# Altium project FOC测试板.PrjPCB
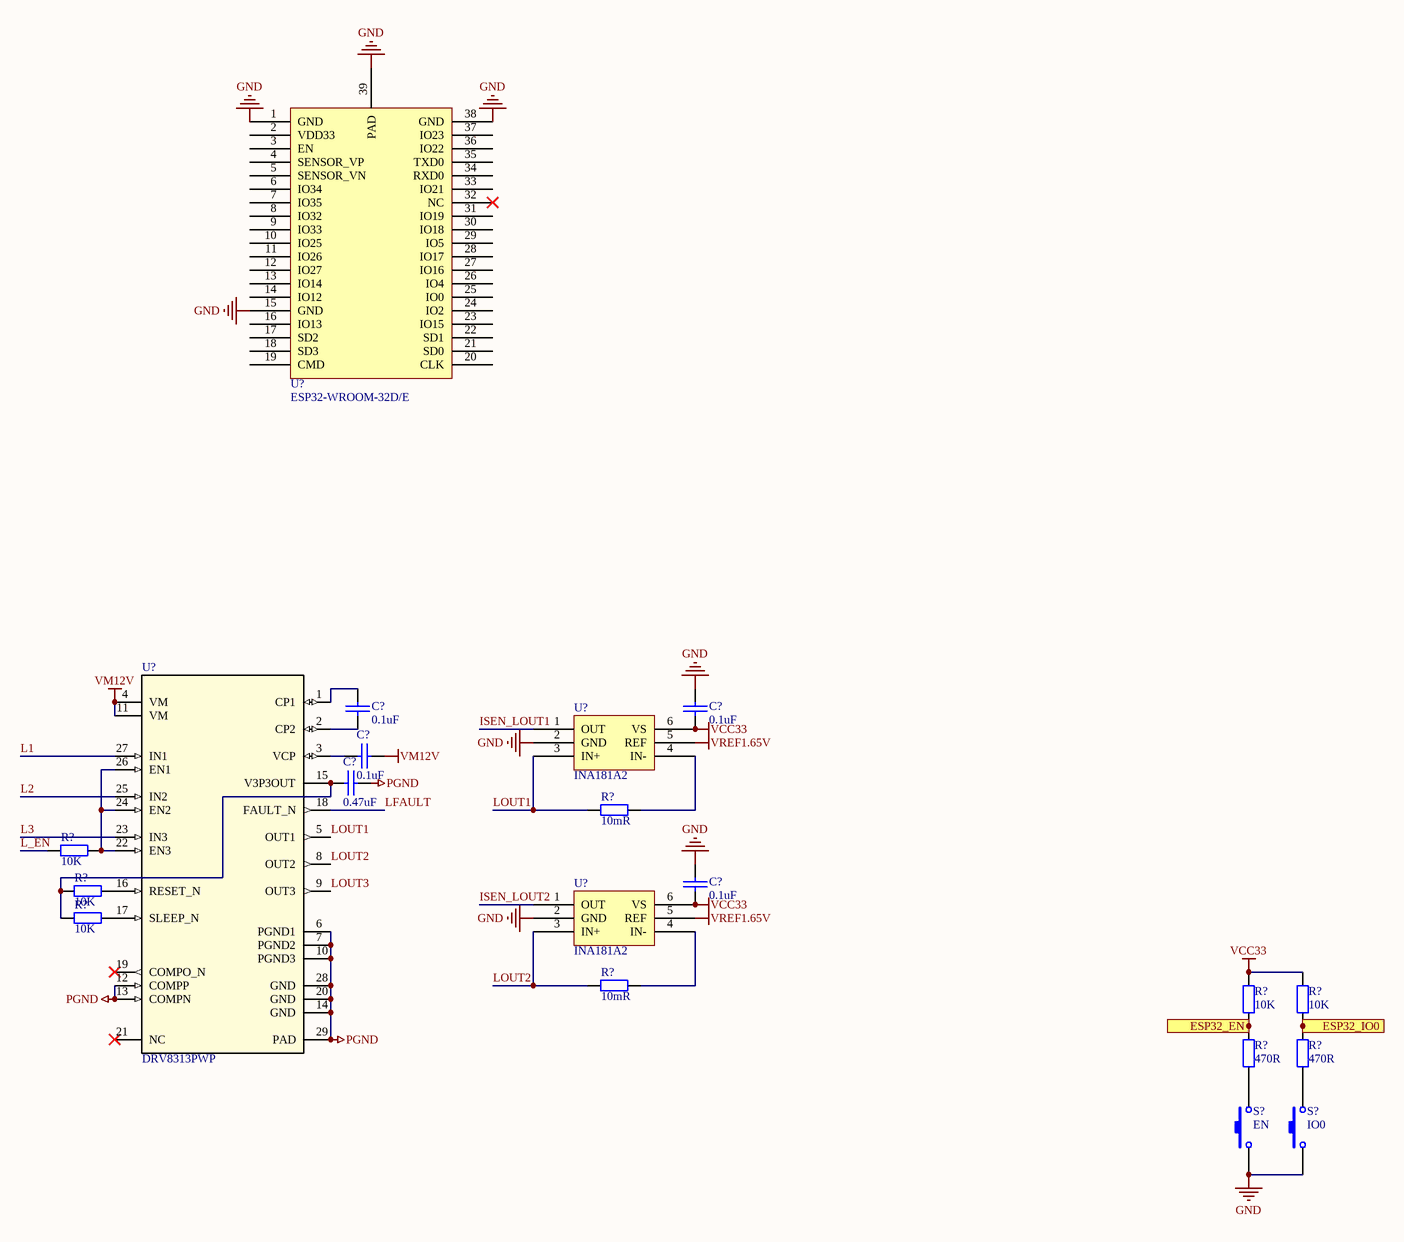
[diagram p0: 原理图.SchDoc]
1 sheet, 20 parts. Net scope: flat (ports and power ports of the same name join across sheets).
Board file: 电路板.PcbDoc

## Sheet 原理图.SchDoc
size A3

### Parts
(Parts that share a designator on the sheet are numbered #1, #2 ... from top to bottom, then left to right.)
C?#1  0.1uF  [C0805_M]
C?#2  0.1uF  [C0805_M]
C?#3  0.1uF  [C0805_M]
C?#4  0.47uF  [C0805_M]
C?#5  0.1uF  [C0805_M]
R?#1  10mR  [R0805_M]
R?#2  10K  [R0805_M]
R?#3  10K  [R0805_M]
R?#4  10K  [R0805_M]
R?#5  10mR  [R0805_M]
R?#6  10K  [R0805_M]
R?#7  10K  [R0805_M]
R?#8  470R  [R0805_M]
R?#9  470R  [R0805_M]
S?#1  EN  [SW_SMT]
S?#2  IO0  [SW_SMT]
U?#1  ESP32-WROOM-32D/E  [ESP32-WROOM-32D/E]
U?#2  INA181A2  [SOT23-6]
U?#3  DRV8313PWP  [TSSOP28-POWERPAD]
U?#4  INA181A2  [SOT23-6]

### Ports
ESP32_EN, ESP32_IO0

### Nets
GND: C?#2.2 C?#5.2 S?#1.1 S?#2.1 U?#1.1(GND) U?#1.15(GND) U?#1.38(GND) U?#1.39(PAD) U?#2.2(GND) U?#4.2(GND)
PGND: C?#4.1 U?#3.6(PGND1) U?#3.7(PGND2) U?#3.10(PGND3) U?#3.12(COMPP) U?#3.13(COMPN) U?#3.14(GND) U?#3.20(GND) U?#3.28(GND) U?#3.29(PAD)
VCC33: C?#2.1 C?#5.1 R?#6.2 R?#7.2 U?#2.6(VS) U?#4.6(VS)
VM12V: C?#3.1 U?#3.4(VM) U?#3.11(VM)
VREF1.65V: U?#2.5(REF) U?#4.5(REF)
ISEN_LOUT1: U?#2.1(OUT)
ISEN_LOUT2: U?#4.1(OUT)
L1: U?#3.27(IN1)
L2: U?#3.25(IN2)
L3: U?#3.23(IN3)
L_EN: R?#2.2
LFAULT: U?#3.18(FAULT_N)
LOUT1: R?#1.2 U?#2.3(IN+) U?#3.5(OUT1)
LOUT2: R?#5.2 U?#3.8(OUT2) U?#4.3(IN+)
LOUT3: U?#3.9(OUT3)
NetC?#1_1: C?#1.1 U?#3.2(CP2)
NetC?#1_2: C?#1.2 U?#3.1(CP1)
NetC?#3_2: C?#3.2 U?#3.3(VCP)
NetC?#4_2: C?#4.2 R?#3.2 R?#4.2 U?#3.15(V3P3OUT)
NetR?#1_1: R?#1.1 U?#2.4(IN-)
NetR?#2_1: R?#2.1 U?#3.22(EN3) U?#3.24(EN2) U?#3.26(EN1)
NetR?#3_1: R?#3.1 U?#3.16(RESET_N)
NetR?#4_1: R?#4.1 U?#3.17(SLEEP_N)
NetR?#5_1: R?#5.1 U?#4.4(IN-)
NetR?#6_1: R?#6.1 R?#8.2 ; port ESP32_EN
NetR?#7_1: R?#7.1 R?#9.2 ; port ESP32_IO0
NetR?#8_1: R?#8.1 S?#1.2
NetR?#9_1: R?#9.1 S?#2.2

Not connected (* = marked no-connect by the designer): U?#1 2(VDD33) 3(EN) 4(SENSOR_VP) 5(SENSOR_VN) 6(IO34) 7(IO35) 8(IO32) 9(IO33) 10(IO25) 11(IO26) 12(IO27) 13(IO14) 14(IO12) 16(IO13) 17(SD2) 18(SD3) 19(CMD) 20(CLK) 21(SD0) 22(SD1) 23(IO15) 24(IO2) 25(IO0) 26(IO4) 27(IO16) 28(IO17) 29(IO5) 30(IO18) 31(IO19) 32(NC)* 33(IO21) 34(RXD0) 35(TXD0) 36(IO22) 37(IO23); U?#3 19(COMPO_N)* 21(NC)*

### Library data of the parts
C?#1-C?#5 = CAP: Capacitor
R?#1-R?#9 = Res2: Resistor; Value: 1K; Published: 8-Jun-2000; LatestRevisionDate: 17-Jul-2002; LatestRevisionNote: Re-released for DXP Platform.; PackageReference: AXIAL-0.4; Publisher: Altium Limited; PackageDescription: Axial Device, Thru-Hole; 2 Leads; 0.4 in Pin Spacing
S?#1 S?#2 = SW-PB: Switch; Published: 24-Mar-1999; LatestRevisionDate: 17-Jul-2002; LatestRevisionNote: Re-released for DXP Platform.; PackageReference: SPST-2; Publisher: Altium Limited; PackageDescription: Switch; 2 Leads
U?#2 U?#4 = INA181A2: Gain=50, SOT23-6
U?#3 = DRV8313PWP: 65-V max 3-A peak 3-phase motor driver with integrated FETs 28-HTSSOP -40 to 125; Manufacturer_Name: Texas Instruments; TYPE: TYPE; RefDes: RefDes; Copyright: Copyright (C) 2025 Ultra Librarian. All rights reserved.; Manufacturer_Part_Number: DRV8313PWP; Datasheet: https://www.ti.com/lit/gpn/drv8313